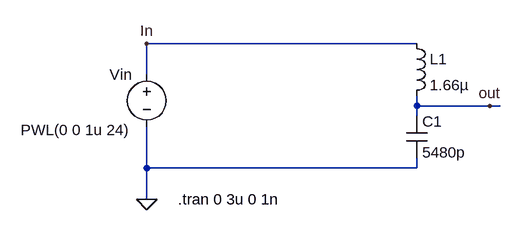
[diagram p0: schematic PULSE_LC_.asc]
PULSE_LC_.asc, the LTspice schematic file:
Version 4
SHEET 1 880 680
WIRE 256 208 -160 208
WIRE -160 256 -160 208
WIRE 256 304 256 288
WIRE 368 304 256 304
WIRE 384 304 368 304
WIRE 256 320 256 304
WIRE -160 400 -160 336
WIRE 256 400 256 384
WIRE 256 400 -160 400
WIRE -160 448 -160 400
FLAG -160 448 0
FLAG -160 208 In
FLAG 368 304 out
SYMBOL ind 240 192 R0
SYMATTR InstName L1
SYMATTR Value 1.66µ
SYMBOL voltage -160 240 R0
WINDOW 123 0 0 Left 2
WINDOW 39 0 0 Left 2
WINDOW 0 -57 16 Left 2
WINDOW 3 -194 101 Left 2
SYMATTR InstName Vin
SYMATTR Value PWL(0 0 1u 24)
SYMBOL cap 240 320 R0
SYMATTR InstName C1
SYMATTR Value 5480p
SYMATTR SpiceLine Rser=2.3m
TEXT -112 448 Left 2 !.tran 0 3u 0 1n

The netlist it stands for:
* PULSE_LC_.asc
L1 In out 1.66µ
Vin In 0 PWL(0 0 1u 24)
C1 out 0 5480p Rser=2.3m
.tran 0 3u 0 1n
.backanno
.end